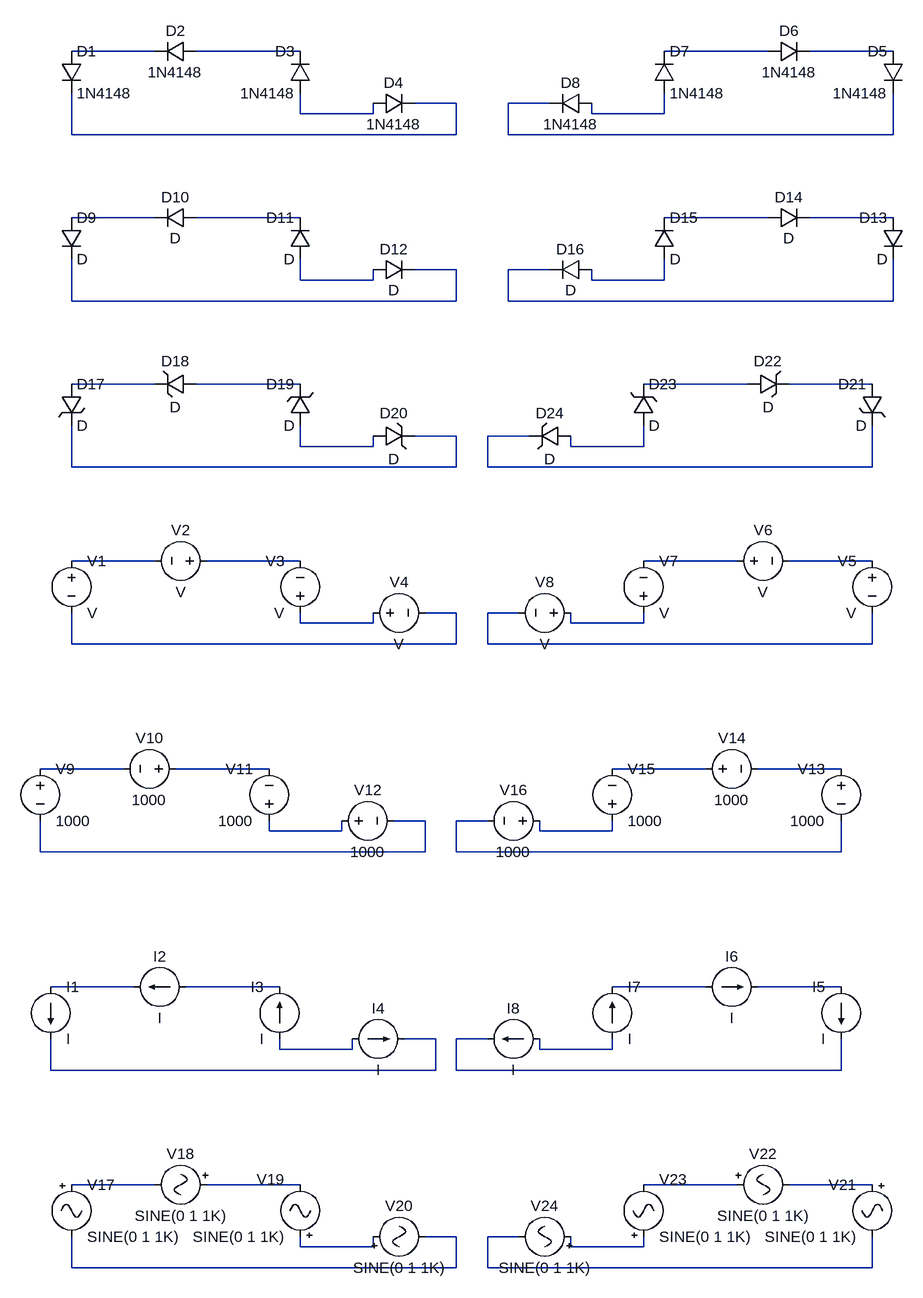
[diagram p0: schematic 06- Other components explicit Defaults - Copy.asc]
06- Other components explicit Defaults - Copy.asc, the LTspice schematic file:
Version 4.1
SHEET 1 1396 2016
WIRE 224 128 96 128
WIRE 448 128 288 128
WIRE 1168 128 1008 128
WIRE 1360 128 1232 128
WIRE 688 208 624 208
WIRE 832 208 768 208
WIRE 448 224 448 192
WIRE 560 224 560 208
WIRE 560 224 448 224
WIRE 896 224 896 208
WIRE 1008 224 1008 192
WIRE 1008 224 896 224
WIRE 96 256 96 192
WIRE 688 256 688 208
WIRE 688 256 96 256
WIRE 768 256 768 208
WIRE 1360 256 1360 192
WIRE 1360 256 768 256
WIRE 224 384 96 384
WIRE 448 384 288 384
WIRE 1168 384 1008 384
WIRE 1360 384 1232 384
WIRE 688 464 624 464
WIRE 832 464 768 464
WIRE 448 480 448 448
WIRE 560 480 560 464
WIRE 560 480 448 480
WIRE 896 480 896 464
WIRE 1008 480 1008 448
WIRE 1008 480 896 480
WIRE 96 512 96 448
WIRE 688 512 688 464
WIRE 688 512 96 512
WIRE 768 512 768 464
WIRE 1360 512 1360 448
WIRE 1360 512 768 512
WIRE 224 640 96 640
WIRE 448 640 288 640
WIRE 1136 640 976 640
WIRE 1328 640 1200 640
WIRE 688 720 624 720
WIRE 800 720 736 720
WIRE 448 736 448 704
WIRE 560 736 560 720
WIRE 560 736 448 736
WIRE 864 736 864 720
WIRE 976 736 976 704
WIRE 976 736 864 736
WIRE 96 768 96 704
WIRE 688 768 688 720
WIRE 688 768 96 768
WIRE 736 768 736 720
WIRE 1328 768 1328 704
WIRE 1328 768 736 768
WIRE 224 912 96 912
WIRE 448 912 304 912
WIRE 1120 912 976 912
WIRE 1328 912 1200 912
WIRE 688 992 640 992
WIRE 784 992 736 992
WIRE 448 1008 448 992
WIRE 560 1008 560 992
WIRE 560 1008 448 1008
WIRE 864 1008 864 992
WIRE 976 1008 976 992
WIRE 976 1008 864 1008
WIRE 96 1040 96 992
WIRE 688 1040 688 992
WIRE 688 1040 96 1040
WIRE 736 1040 736 992
WIRE 1328 1040 1328 992
WIRE 1328 1040 736 1040
WIRE 176 1232 48 1232
WIRE 400 1232 256 1232
WIRE 1072 1232 928 1232
WIRE 1280 1232 1152 1232
WIRE 640 1312 592 1312
WIRE 736 1312 688 1312
WIRE 400 1328 400 1312
WIRE 512 1328 512 1312
WIRE 512 1328 400 1328
WIRE 816 1328 816 1312
WIRE 928 1328 928 1312
WIRE 928 1328 816 1328
WIRE 48 1360 48 1312
WIRE 640 1360 640 1312
WIRE 640 1360 48 1360
WIRE 688 1360 688 1312
WIRE 1280 1360 1280 1312
WIRE 1280 1360 688 1360
WIRE 192 1568 64 1568
WIRE 416 1568 272 1568
WIRE 1072 1568 928 1568
WIRE 1280 1568 1152 1568
WIRE 656 1648 608 1648
WIRE 736 1648 688 1648
WIRE 416 1664 416 1648
WIRE 528 1664 528 1648
WIRE 528 1664 416 1664
WIRE 816 1664 816 1648
WIRE 928 1664 928 1648
WIRE 928 1664 816 1664
WIRE 64 1696 64 1648
WIRE 656 1696 656 1648
WIRE 656 1696 64 1696
WIRE 688 1696 688 1648
WIRE 1280 1696 1280 1648
WIRE 1280 1696 688 1696
WIRE 224 1872 96 1872
WIRE 448 1872 304 1872
WIRE 1120 1872 976 1872
WIRE 1328 1872 1200 1872
WIRE 688 1952 640 1952
WIRE 784 1952 736 1952
WIRE 448 1968 448 1952
WIRE 560 1968 560 1952
WIRE 560 1968 448 1968
WIRE 864 1968 864 1952
WIRE 976 1968 976 1952
WIRE 976 1968 864 1968
WIRE 96 2000 96 1952
WIRE 688 2000 688 1952
WIRE 688 2000 96 2000
WIRE 736 2000 736 1952
WIRE 1328 2000 1328 1952
WIRE 1328 2000 736 2000
SYMBOL diode 80 128 R0
SYMATTR InstName D1
SYMATTR Value 1N4148
SYMBOL diode 288 112 R90
WINDOW 0 0 32 VBottom 2
WINDOW 3 32 32 VTop 2
SYMATTR InstName D2
SYMATTR Value 1N4148
SYMBOL diode 464 192 R180
WINDOW 0 24 64 Left 2
WINDOW 3 24 0 Left 2
SYMATTR InstName D3
SYMATTR Value 1N4148
SYMBOL diode 560 224 R270
WINDOW 0 32 32 VTop 2
WINDOW 3 0 32 VBottom 2
SYMATTR InstName D4
SYMATTR Value 1N4148
SYMBOL diode 1376 128 M0
SYMATTR InstName D5
SYMATTR Value 1N4148
SYMBOL diode 1168 112 M90
WINDOW 0 0 32 VBottom 2
WINDOW 3 32 32 VTop 2
SYMATTR InstName D6
SYMATTR Value 1N4148
SYMBOL diode 992 192 M180
WINDOW 0 24 64 Left 2
WINDOW 3 24 0 Left 2
SYMATTR InstName D7
SYMATTR Value 1N4148
SYMBOL diode 896 224 M270
WINDOW 0 32 32 VTop 2
WINDOW 3 0 32 VBottom 2
SYMATTR InstName D8
SYMATTR Value 1N4148
SYMBOL diode 80 384 R0
SYMATTR InstName D9
SYMBOL diode 288 368 R90
WINDOW 0 0 32 VBottom 2
WINDOW 3 32 32 VTop 2
SYMATTR InstName D10
SYMBOL diode 464 448 R180
WINDOW 0 24 64 Left 2
WINDOW 3 24 0 Left 2
SYMATTR InstName D11
SYMBOL diode 560 480 R270
WINDOW 0 32 32 VTop 2
WINDOW 3 0 32 VBottom 2
SYMATTR InstName D12
SYMBOL diode 1376 384 M0
SYMATTR InstName D13
SYMBOL diode 1168 368 M90
WINDOW 0 0 32 VBottom 2
WINDOW 3 32 32 VTop 2
SYMATTR InstName D14
SYMBOL diode 992 448 M180
WINDOW 0 24 64 Left 2
WINDOW 3 24 0 Left 2
SYMATTR InstName D15
SYMBOL diode 896 480 M270
WINDOW 0 32 32 VTop 2
WINDOW 3 0 32 VBottom 2
SYMATTR InstName D16
SYMBOL zener 80 640 R0
SYMATTR InstName D17
SYMBOL zener 288 624 R90
WINDOW 0 -4 32 VBottom 2
WINDOW 3 36 32 VTop 2
SYMATTR InstName D18
SYMBOL zener 464 704 R180
WINDOW 0 24 64 Left 2
WINDOW 3 24 0 Left 2
SYMATTR InstName D19
SYMBOL zener 560 736 R270
WINDOW 0 36 32 VTop 2
WINDOW 3 -4 32 VBottom 2
SYMATTR InstName D20
SYMBOL zener 1344 640 M0
SYMATTR InstName D21
SYMBOL zener 1136 624 M90
WINDOW 0 -4 32 VBottom 2
WINDOW 3 36 32 VTop 2
SYMATTR InstName D22
SYMBOL zener 960 704 M180
WINDOW 0 24 64 Left 2
WINDOW 3 24 0 Left 2
SYMATTR InstName D23
SYMBOL zener 864 736 M270
WINDOW 0 36 32 VTop 2
WINDOW 3 -4 32 VBottom 2
SYMATTR InstName D24
SYMBOL voltage 96 896 R0
SYMATTR InstName V1
SYMBOL voltage 320 912 R90
WINDOW 0 -32 56 VBottom 2
WINDOW 3 32 56 VTop 2
SYMATTR InstName V2
SYMBOL voltage 448 1008 R180
WINDOW 0 24 96 Left 2
WINDOW 3 24 16 Left 2
SYMATTR InstName V3
SYMBOL voltage 544 992 R270
WINDOW 0 32 56 VTop 2
WINDOW 3 -32 56 VBottom 2
SYMATTR InstName V4
SYMBOL voltage 1328 896 M0
SYMATTR InstName V5
SYMBOL voltage 1104 912 M90
WINDOW 0 -32 56 VBottom 2
WINDOW 3 32 56 VTop 2
SYMATTR InstName V6
SYMBOL voltage 976 1008 M180
WINDOW 0 24 96 Left 2
WINDOW 3 24 16 Left 2
SYMATTR InstName V7
SYMBOL voltage 880 992 M270
WINDOW 0 32 56 VTop 2
WINDOW 3 -32 56 VBottom 2
SYMATTR InstName V8
SYMBOL voltage 48 1216 R0
SYMATTR InstName V9
SYMATTR Value 1000
SYMBOL voltage 272 1232 R90
WINDOW 0 -32 56 VBottom 2
WINDOW 3 32 56 VTop 2
SYMATTR InstName V10
SYMATTR Value 1000
SYMBOL voltage 400 1328 R180
WINDOW 0 24 96 Left 2
WINDOW 3 24 16 Left 2
SYMATTR InstName V11
SYMATTR Value 1000
SYMBOL voltage 496 1312 R270
WINDOW 0 32 56 VTop 2
WINDOW 3 -32 56 VBottom 2
SYMATTR InstName V12
SYMATTR Value 1000
SYMBOL voltage 1280 1216 M0
SYMATTR InstName V13
SYMATTR Value 1000
SYMBOL voltage 1056 1232 M90
WINDOW 0 -32 56 VBottom 2
WINDOW 3 32 56 VTop 2
SYMATTR InstName V14
SYMATTR Value 1000
SYMBOL voltage 928 1328 M180
WINDOW 0 24 96 Left 2
WINDOW 3 24 16 Left 2
SYMATTR InstName V15
SYMATTR Value 1000
SYMBOL voltage 832 1312 M270
WINDOW 0 32 56 VTop 2
WINDOW 3 -32 56 VBottom 2
SYMATTR InstName V16
SYMATTR Value 1000
SYMBOL current 64 1568 R0
SYMATTR InstName I1
SYMBOL current 272 1568 R90
WINDOW 0 -32 40 VBottom 2
WINDOW 3 32 40 VTop 2
SYMATTR InstName I2
SYMBOL current 416 1648 R180
WINDOW 0 24 80 Left 2
WINDOW 3 24 0 Left 2
SYMATTR InstName I3
SYMBOL current 528 1648 R270
WINDOW 0 32 40 VTop 2
WINDOW 3 -32 40 VBottom 2
SYMATTR InstName I4
SYMBOL current 1280 1568 M0
SYMATTR InstName I5
SYMBOL current 1072 1568 M90
WINDOW 0 -32 40 VBottom 2
WINDOW 3 32 40 VTop 2
SYMATTR InstName I6
SYMBOL current 928 1648 M180
WINDOW 0 24 80 Left 2
WINDOW 3 24 0 Left 2
SYMATTR InstName I7
SYMBOL current 816 1648 M270
WINDOW 0 32 40 VTop 2
WINDOW 3 -32 40 VBottom 2
SYMATTR InstName I8
SYMBOL Misc\\signal 96 1856 R0
SYMATTR InstName V17
SYMBOL Misc\\signal 320 1872 R90
WINDOW 0 -32 56 VBottom 2
WINDOW 3 32 56 VTop 2
SYMATTR InstName V18
SYMBOL Misc\\signal 448 1968 R180
WINDOW 0 24 104 Left 2
WINDOW 3 24 16 Left 2
SYMATTR InstName V19
SYMBOL Misc\\signal 544 1952 R270
WINDOW 0 32 56 VTop 2
WINDOW 3 -32 56 VBottom 2
SYMATTR InstName V20
SYMBOL Misc\\signal 1328 1856 M0
SYMATTR InstName V21
SYMBOL Misc\\signal 1104 1872 M90
WINDOW 0 -32 56 VBottom 2
WINDOW 3 32 56 VTop 2
SYMATTR InstName V22
SYMBOL Misc\\signal 976 1968 M180
WINDOW 0 24 104 Left 2
WINDOW 3 24 16 Left 2
SYMATTR InstName V23
SYMBOL Misc\\signal 880 1952 M270
WINDOW 0 32 56 VTop 2
WINDOW 3 -32 56 VBottom 2
SYMATTR InstName V24

The netlist it stands for:
* 06- Other components explicit Defaults - Copy.asc
D1 N001 N005 1N4148
D2 N002 N001 1N4148
D3 N007 N002 1N4148
D4 N007 N005 1N4148
D5 N004 N006 1N4148
D6 N003 N004 1N4148
D7 N008 N003 1N4148
D8 N008 N006 1N4148
D9 N009 N013 D
D10 N010 N009 D
D11 N015 N010 D
D12 N015 N013 D
D13 N012 N014 D
D14 N011 N012 D
D15 N016 N011 D
D16 N016 N014 D
D17 N017 N021 D
D18 N018 N017 D
D19 N023 N018 D
D20 N023 N021 D
D21 N020 N022 D
D22 N019 N020 D
D23 N024 N019 D
D24 N024 N022 D
V1 N025 N029 V
V2 N026 N025 V
V3 N031 N026 V
V4 N031 N029 V
V5 N028 N030 V
V6 N027 N028 V
V7 N032 N027 V
V8 N032 N030 V
V9 N033 N037 1000
V10 N034 N033 1000
V11 N039 N034 1000
V12 N039 N037 1000
V13 N036 N038 1000
V14 N035 N036 1000
V15 N040 N035 1000
V16 N040 N038 1000
I1 N041 N045 I
I2 N042 N041 I
I3 N047 N042 I
I4 N047 N045 I
I5 N044 N046 I
I6 N043 N044 I
I7 N048 N043 I
I8 N048 N046 I
V17 N049 N053 SINE(0 1 1K)
V18 N050 N049 SINE(0 1 1K)
V19 N055 N050 SINE(0 1 1K)
V20 N055 N053 SINE(0 1 1K)
V21 N052 N054 SINE(0 1 1K)
V22 N051 N052 SINE(0 1 1K)
V23 N056 N051 SINE(0 1 1K)
V24 N056 N054 SINE(0 1 1K)
.model D D
.lib standard.dio
.backanno
.end